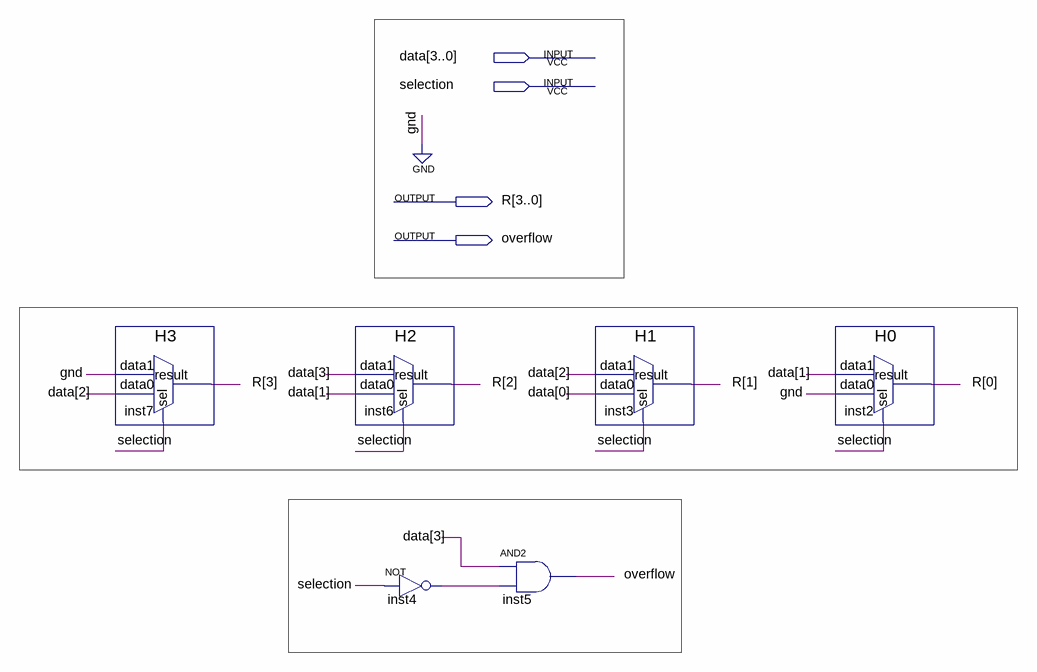
[diagram p0: schematic sheet]
// Quartus schematic RL_ShiftUnit.bdf as structural Verilog: 6 symbols, 4 pins
module RL_ShiftUnit (
  input  [3:0] data,
  input  selection,
  output [3:0] R,
  output overflow
);

  wire inst4_out;

  H3 inst7 (.data1(1'b0), .data0(data[2]), .sel(selection), .result(R[3]));
  H2 inst6 (.data1(data[3]), .data0(data[1]), .sel(selection), .result(R[2]));
  not inst4 (inst4_out, selection);
  and inst5 (overflow, data[3], inst4_out);
  H1 inst3 (.data1(data[2]), .data0(data[0]), .sel(selection), .result(R[1]));
  H0 inst2 (.data1(data[1]), .data0(1'b0), .sel(selection), .result(R[0]));
endmodule
